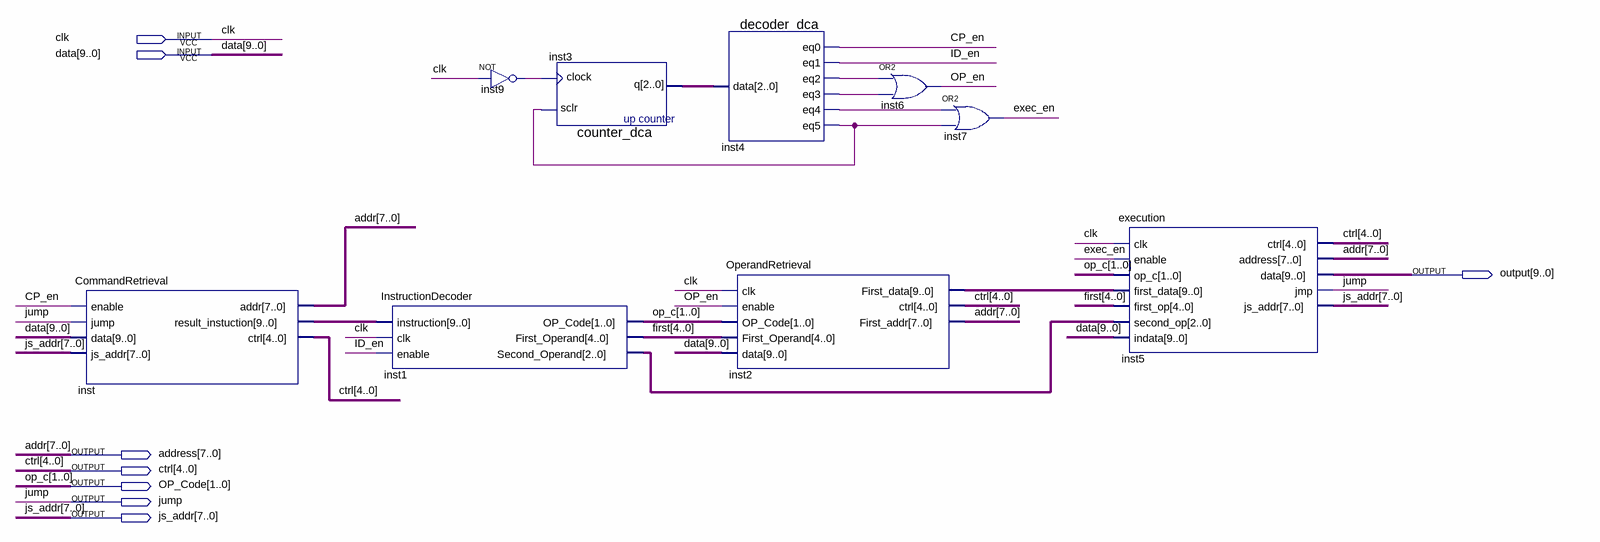
[diagram p0: schematic sheet]
// Quartus schematic ControlUnit.bdf as structural Verilog: 9 symbols, 8 pins
module ControlUnit (
  input  clk,
  input  [9:0] data,
  output [9:0] \output ,
  output [7:0] address,
  output [4:0] ctrl,
  output [1:0] OP_Code,
  output jump,
  output [7:0] js_addr
);

  wire CP_en, exec_en, ID_en, inst4_eq2, inst4_eq3, inst4_eq4, inst4_eq5, inst9_out, OP_en;
  wire [2:0] inst1_second_operand, inst3_q;
  wire [4:0] first;
  wire [9:0] inst2_first_data, inst_result_instuction;

  CommandRetrieval inst (
    .enable(CP_en), .jump(jump), .data(data), .js_addr(js_addr), .addr(address),
    .result_instuction(inst_result_instuction), .ctrl(ctrl));
  InstructionDecoder inst1 (
    .instruction(inst_result_instuction), .clk(clk), .enable(ID_en), .OP_Code(OP_Code),
    .First_Operand(first), .Second_Operand(inst1_second_operand));
  not inst9 (inst9_out, clk);
  counter_dca inst3 (.sclr(inst4_eq5), .clock(inst9_out), .q(inst3_q));
  decoder_dca inst4 (
    .data(inst3_q), .eq0(CP_en), .eq1(ID_en), .eq2(inst4_eq2), .eq3(inst4_eq3), .eq4(inst4_eq4),
    .eq5(inst4_eq5));
  OperandRetrieval inst2 (
    .clk(clk), .enable(OP_en), .OP_Code(OP_Code), .First_Operand(first), .data(data),
    .First_data(inst2_first_data), .ctrl(ctrl), .First_addr(address));
  or inst6 (OP_en, inst4_eq2, inst4_eq3);
  or inst7 (exec_en, inst4_eq4, inst4_eq5);
  execution inst5 (
    .clk(clk), .enable(exec_en), .op_c(OP_Code), .first_data(inst2_first_data), .first_op(first),
    .second_op(inst1_second_operand), .indata(data), .ctrl(ctrl), .address(address), .data(\output ),
    .jmp(jump), .js_addr(js_addr));

  // Other names for the same wires on the sheet: addr[7:0] = address; op_c[1:0] = OP_Code
endmodule
